# Altium schematic sheet Input-Battery.SchDoc
size A; SheetNumber: 1; SheetTotal: 3
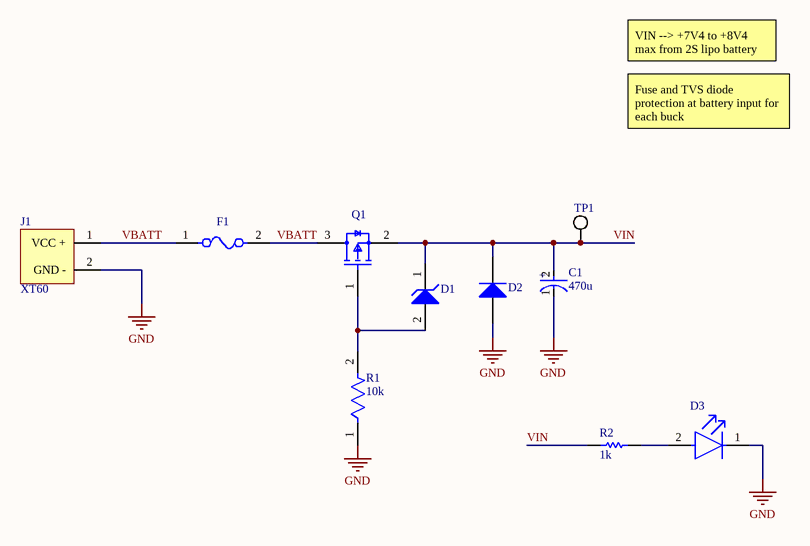
[diagram p0: Input-Battery.SchDoc]

## Parts
C1  470u  [FP-RAD-TH-D_10_0_5-L_12_5-MFG]
D1  MMSZ12T1G  [ONSC-SOD-123-2-425-04_V]  (value not drawn)
D2  SMAJ10A-E3/61  [VISH-DO-214AC-2_L]  (value not drawn)
D3  598-8270-107F  [FP-598-8270-107F-MFG]  (value not drawn)
F1  0452004.MRL  [FP-0452-MFG]  (value not drawn)
J1  XT60  [XT60-Footprint-1]
Q1  DMP3099L-13  [FP-SOT23-IPC_A]  (value not drawn)
R1  10k  [FP-AC1206-MFG]
R2  1k  [RESC3216X60X45ML10T20]
TP1  Test Point  [Test Point]  (value not drawn)

## Nets
GND: C1.1(C) D2.2(A) D3.1(C) J1.2(GND_-) R1.1
VBATT: F1.1 F1.2 J1.1(VCC_+) Q1.3(D)
VIN: C1.2(A) D1.1(K) D2.1(K) Q1.2(S) R2.1 TP1.1
NetD1_2: D1.2(A) Q1.1(G) R1.2
NetD3_2: D3.2(A) R2.2

## Notes on the sheet
- VIN --> +7V4 to +8V4 max from 2S lipo battery
- Fuse and TVS diode protection at battery input for each buck
- (in symbol CMP-05427-001980-1) +

## Library data of the parts
C1 = CMP-05427-001980-1: Aluminum Electrolytic Capacitors (Radial Lead Type) 470uF ±20% 16V; Ripple Current: 1.29A; ESR (Equivalent Series Resistance): 38mR; Life (Hours): 4000Hour; Lead Diameter: 0.6mm; Height: 12.5mm; Package Quantity: 500; Lead Free: Lead Free; Voltage Rating: 16V; Diameter: 10mm; Radiation Hardening: No; Packaging: Tape and Reel; Case/Package: Radial; Tolerance: 20%; Series: FM; Capacitance: 470uF; Height - Seated (Max): 0.551inch; Max Operating Temperature: 105°C; Termination: Radial; Mount: Through Hole; RoHS Compliant: Yes; Voltage Rating (DC): 16V; Impedance: 38mR; Length: 12.5mm; Lead Pitch: 5mm; Min Operating Temperature: -40°C
D1 = CMP-1060-00269-1: Zener Voltage Regulator, 500 mW, 2-Pin SOD-123, Pb-Free, Tape and Reel; Manufacturer: On Semiconductor; P Max (W): 0.5; Packing: Tape and Reel; Mounting Technology: Surface Mount; PartNumber: MMSZ12T1G; PackageReference: SOD-123-2-425-04; ComponentLink1URL: http://www.onsemi.com/; RoHS: Pb-Free; PackageDescription: 2-Pin SOD, Body 1.6 x 2.69 mm; PackageVersion: Rev. G, 10/2009; ComponentLink2URL: http://www.onsemi.com/pub_link/Collateral/MMSZ2V4T1-D.PDF; ComponentLink3URL: http://www.onsemi.com/pub_link/Collateral/425-04.PDF; DatasheetVersion: Rev. 11; ComponentLink2Description: Datasheet; ComponentLink1Description: Manufacturer URL; ComponentLink3Description: Package Specification
D2 = CMP-0548-00238-2: Transient Voltage Suppressor, 6.40 to 231 V, 10 V Stand-off Voltage, Uni-Directional, -55 to 155 degC, 2-pin DO-214AC, Pb-Free, Tape and Reel; Manufacturer: Vishay Semiconductor; VBR Uni-Directional (V): 6.4 to 231; ID (uA): 1; IFSM: 40 A; VWM (V): 10; PPPM (W): 400, 300; PackageReference: DO-214AC-2; ComponentLink2URL: http://www.vishay.com/docs/88390/smaj50a.pdf; Operating Junction and Storage Temperature Range: -55 to 150 degC; DatasheetVersion: 12/8/2013; PartNumber: SMAJ10A-E3/61; ComponentLink3URL: http://www.vishay.com/docs/88390/smaj50a.pdf; ComponentLink1Description: Manufacturer URL; ComponentLink1URL: http://www.vishay.com/; PackageDescription: 2-Pin DO-214AC (SMA), Body 4.245 x 2.665 mm; ComponentLink3Description: Package Specification; RoHS: TRUE; Packing: Tape and Reel; Mounting Technology: Surface Mount; ComponentLink2Description: Datasheet
D3 = CMP-15384-000006-1: SM LED 1206 ALINGAP G 7 REEL; Reverse Voltage: 5V; Viewing Angle: 140°; Power Dissipation: 60mW; Number of Elements: 1; Luminous Intensity: 20mcd; Color: Green; Lens Size: 1.6mm; Dominant Wavelength: 570nm; Test Current: 20mA; Forward Voltage: 2V; Lens Color: Colorless; Lens Transparency: Clear; Lens Style: Flat; Case/Package: 1206; RoHS Compliant: Yes; Number of Pins: 2; Packaging: Tape and Reel; Case Code (Metric): 3216; Lead Free: Lead Free; REACH SVHC: No SVHC; Height: 0.7mm; Depth: 1.6mm; Radiation Hardening: No; Length: 3.2mm; Wavelength: 570nm; Illumination Color: Green; Max Operating Temperature: 85°C; Min Operating Temperature: -30°C; Case Code (Imperial): 1206; Series: 598; Package Quantity: 3000; Mount: Surface Mount; Number of LEDs: 1; Forward Current: 20mA; Width: 1.6mm
F1 = CMP-08605-000077-1: FUSE BRD MNT 4A 125VAC/VDC 2SMD; Manufacturer: Littelfuse Inc; Max Fuse Dc Voltage: 125V; Fuse I2T: 34.4A2Sec; Fuse Interrupt Ac Current: 50A; Fuse Interrupt Dc Current: 300A; Fuse Blow Speed: Slow; Value: 0.0186Ω; Digikey Description: FUSE BRD MNT 4A 125VAC/VDC 2SMD; Voltage Rating: 125V; Height: 2.94mm; Device Class L2: Fuses; Lead Free: Yes; Manufacturer Part Number: 0452004.MRL; Automotive: No; Fuse Current: 4A; Device Class L3: unset; RoHS: TRUE; Max Fuse Ac Voltage: 125V; Temperature Range Low: -55°C; Category: Fuse; Device Class L1: Circuit Protection; ComponentLink2Description: Datasheet; Temperature: -55°C to +125°C; ComponentLink2URL: https://www.littelfuse.com/~/media/electronics/datasheets/fuses/littelfuse_fuse_452_454_datasheet.pdf.pdf; Temperature Range High: +125°C; Octopart: https://octopart.com/0452004.mrl-littelfuse-566421; Mouser Description: Surface Mount Fuses 125V 4A; Resistance: 0.0186Ω; Package: 0452
J1 = CMP-002-00074-3: Connector for Lipo Batteries with XT60 connectors
Q1 = CMP-12801-000102-1: MOSFET P-CH 30V 3.8A SOT23; Fall Time: 15ns; Turn-Off Delay Time: 31ns; Rds On Max: 65mR; Rise Time: 5ns; Gate to Source Voltage (Vgs): 20V; Number of Channels: 1; Max Power Dissipation: 1.08W; Turn-On Delay Time: 4.8ns; Element Configuration: Single; Input Capacitance: 563pF; Weight: 0.000282oz; Case/Package: TO-236-3; Drain to Source Voltage (Vdss): 30V; Package Quantity: 10000; Min Operating Temperature: -55°C; Radiation Hardening: No; REACH SVHC: No SVHC; Drain to Source Resistance: 65mR; Packaging: Tape and Reel; Lead Free: Lead Free; Number of Pins: 3; Mount: Surface Mount; Max Operating Temperature: 150°C; Continuous Drain Current (ID): 3.8A
R1 = CMP-03412-020699-1: AC1206 10KΩ 0.25W 1.00%; Manufacturer Part Number: AC1206FR-1310KL; Manufacturer: Yageo; Tolerance: 0.01; Automotive Grade: Grade 0; Voltage Rating: 200V; Lead Free: Yes; Resistance: 10KΩ; Device Class L1: Passive Components; Package: AC1206; Temperature: -55°C to +155°C; ComponentLink2Description: Datasheet; Power Rating: 0.25W; Device Class L2: Resistors; Temperature Range Low: -55°C; Ipc Land Pattern Name: RESC310160X55; ComponentLink2URL: http://www.yageo.com/NewPortal/yageodocoutput?fileName=/pdf/R-Chip/PYu-AC_51_RoHS_L_6.pdf; Height: 0.65mm; Composition: Thick Film; Device Class L3: Chip SMD Resistors; Automotive: Yes; Category: Res; Footprint Url: http://www.yageo.com/exep/pages/download/literatures/PYu-R_Mount_10.pdf; Temperature Range High: +155°C; Octopart: https://octopart.com/ac1206fr-1310kl-yageo-74169507; RoHS: TRUE; Value: 10KΩ; Series: AC
R2 = CMP-2003-01869-1: Manufacturer: Vishay Dale; Part Number: CRCW12061K00JNTA
TP1 = CMP-00030-00006-7